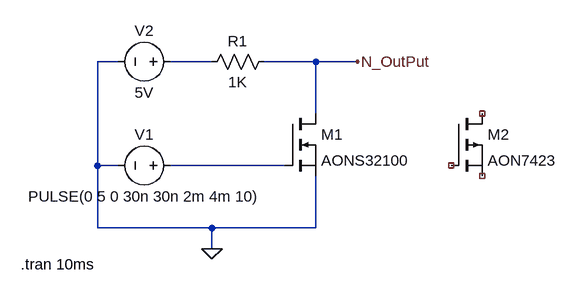
[diagram p0: schematic Porte NOT.asc]
Porte NOT.asc, the LTspice schematic file:
Version 4
SHEET 1 880 680
WIRE -144 32 -176 32
WIRE 0 32 -64 32
WIRE 160 32 80 32
WIRE 224 32 160 32
WIRE 160 112 160 32
WIRE -176 192 -176 32
WIRE -144 192 -176 192
WIRE 112 192 -64 192
WIRE -176 288 -176 192
WIRE 0 288 -176 288
WIRE 160 288 160 208
WIRE 160 288 0 288
WIRE 0 320 0 288
FLAG 224 32 N_OutPut
FLAG 0 320 0
SYMBOL voltage -48 192 R90
WINDOW 0 -32 56 VBottom 2
WINDOW 3 32 56 VTop 2
WINDOW 123 0 0 Left 0
WINDOW 39 0 0 Left 0
SYMATTR InstName V1
SYMATTR Value PULSE(0 5 0 30n 30n 2m 4m 10)
SYMBOL nmos 112 112 R0
SYMATTR InstName M1
SYMATTR Value AONS32100
SYMBOL voltage -48 32 R90
WINDOW 0 -32 56 VBottom 2
WINDOW 3 32 56 VTop 2
WINDOW 123 0 0 Left 0
WINDOW 39 0 0 Left 0
SYMATTR InstName V2
SYMATTR Value 5V
SYMBOL res 96 16 R90
WINDOW 0 0 56 VBottom 2
WINDOW 3 32 56 VTop 2
SYMATTR InstName R1
SYMATTR Value 1K
SYMBOL pmos 368 112 R0
SYMATTR InstName M2
SYMATTR Value AON7423
TEXT -294 344 Left 2 !.tran 10ms

The netlist it stands for:
* Porte NOT.asc
V1 N002 0 PULSE(0 5 0 30n 30n 2m 4m 10)
M1 N_OutPut N002 0 0 AONS32100
V2 N001 0 5V
R1 N_OutPut N001 1K
M2 NC_01 NC_02 NC_03 NC_03 AON7423
.model NMOS NMOS
.model PMOS PMOS
.lib standard.mos
.tran 10ms
.backanno
.end